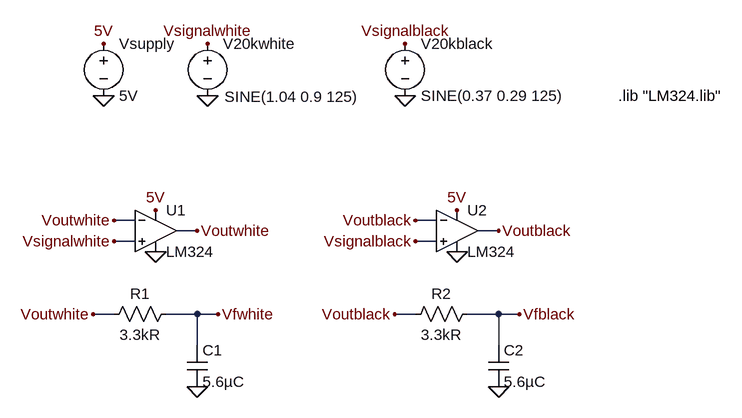
[diagram p0: schematic LTspice.asc]
LTspice.asc, the LTspice schematic file:
Version 4.1
SHEET 1 1648 680
WIRE -256 0 -288 0
WIRE 208 0 176 0
WIRE -160 16 -192 16
WIRE 304 16 272 16
WIRE -256 32 -288 32
WIRE 208 32 176 32
WIRE -288 144 -320 144
WIRE -160 144 -208 144
WIRE -128 144 -160 144
WIRE 176 144 144 144
WIRE 304 144 256 144
WIRE 336 144 304 144
WIRE -160 192 -160 144
WIRE 304 192 304 144
FLAG -304 -192 0
FLAG -304 -272 5V
FLAG -224 -16 5V
FLAG -224 48 0
FLAG -288 0 Voutwhite
FLAG -160 16 Voutwhite
FLAG -144 -192 0
FLAG -144 -272 Vsignalwhite
FLAG -288 32 Vsignalwhite
FLAG 160 -192 0
FLAG 160 -272 Vsignalblack
FLAG 240 -16 5V
FLAG 240 48 0
FLAG 176 0 Voutblack
FLAG 304 16 Voutblack
FLAG 176 32 Vsignalblack
FLAG -160 256 0
FLAG -320 144 Voutwhite
FLAG -128 144 Vfwhite
FLAG 304 256 0
FLAG 144 144 Voutblack
FLAG 336 144 Vfblack
SYMBOL OpAmps\\opamp2 -224 -48 R0
SYMATTR InstName U1
SYMATTR Value LM324
SYMBOL voltage -304 -288 R0
SYMATTR InstName Vsupply
SYMATTR Value 5V
SYMBOL voltage -144 -288 R0
WINDOW 3 26 98 Left 2
WINDOW 123 24 44 Left 2
WINDOW 39 0 0 Left 0
SYMATTR Value SINE(1.04 0.9 125)
SYMATTR InstName V20kwhite
SYMBOL voltage 160 -288 R0
WINDOW 123 0 0 Left 0
WINDOW 39 0 0 Left 0
SYMATTR InstName V20kblack
SYMATTR Value SINE(0.37 0.29 125)
SYMBOL OpAmps\\opamp2 240 -48 R0
SYMATTR InstName U2
SYMATTR Value LM324
SYMBOL res -192 128 R90
WINDOW 0 0 56 VBottom 2
WINDOW 3 32 56 VTop 2
SYMATTR InstName R1
SYMATTR Value 3.3kR
SYMBOL cap -176 192 R0
SYMATTR InstName C1
SYMATTR Value 5.6µC
SYMBOL res 272 128 R90
WINDOW 0 0 56 VBottom 2
WINDOW 3 32 56 VTop 2
SYMATTR InstName R2
SYMATTR Value 3.3kR
SYMBOL cap 288 192 R0
SYMATTR InstName C2
SYMATTR Value 5.6µC
TEXT 488 -192 Left 2 !.lib "LM324.lib"

The netlist it stands for:
* LTspice.asc
X§U1 Vsignalwhite Voutwhite 5V 0 Voutwhite LM324  ; pins In+ In- V+ V- OUT
Vsupply 5V 0 5V
V20kwhite Vsignalwhite 0 SINE(1.04 0.9 125)
V20kblack Vsignalblack 0 SINE(0.37 0.29 125)
X§U2 Vsignalblack Voutblack 5V 0 Voutblack LM324  ; pins In+ In- V+ V- OUT
R1 Vfwhite Voutwhite 3.3kR
C1 Vfwhite 0 5.6µC
R2 Vfblack Voutblack 3.3kR
C2 Vfblack 0 5.6µC
.lib "LM324.lib"
.backanno
.end